# Altium schematic sheet MCU.SchDoc
size A4; SheetNumber: 3; SheetTotal: 4
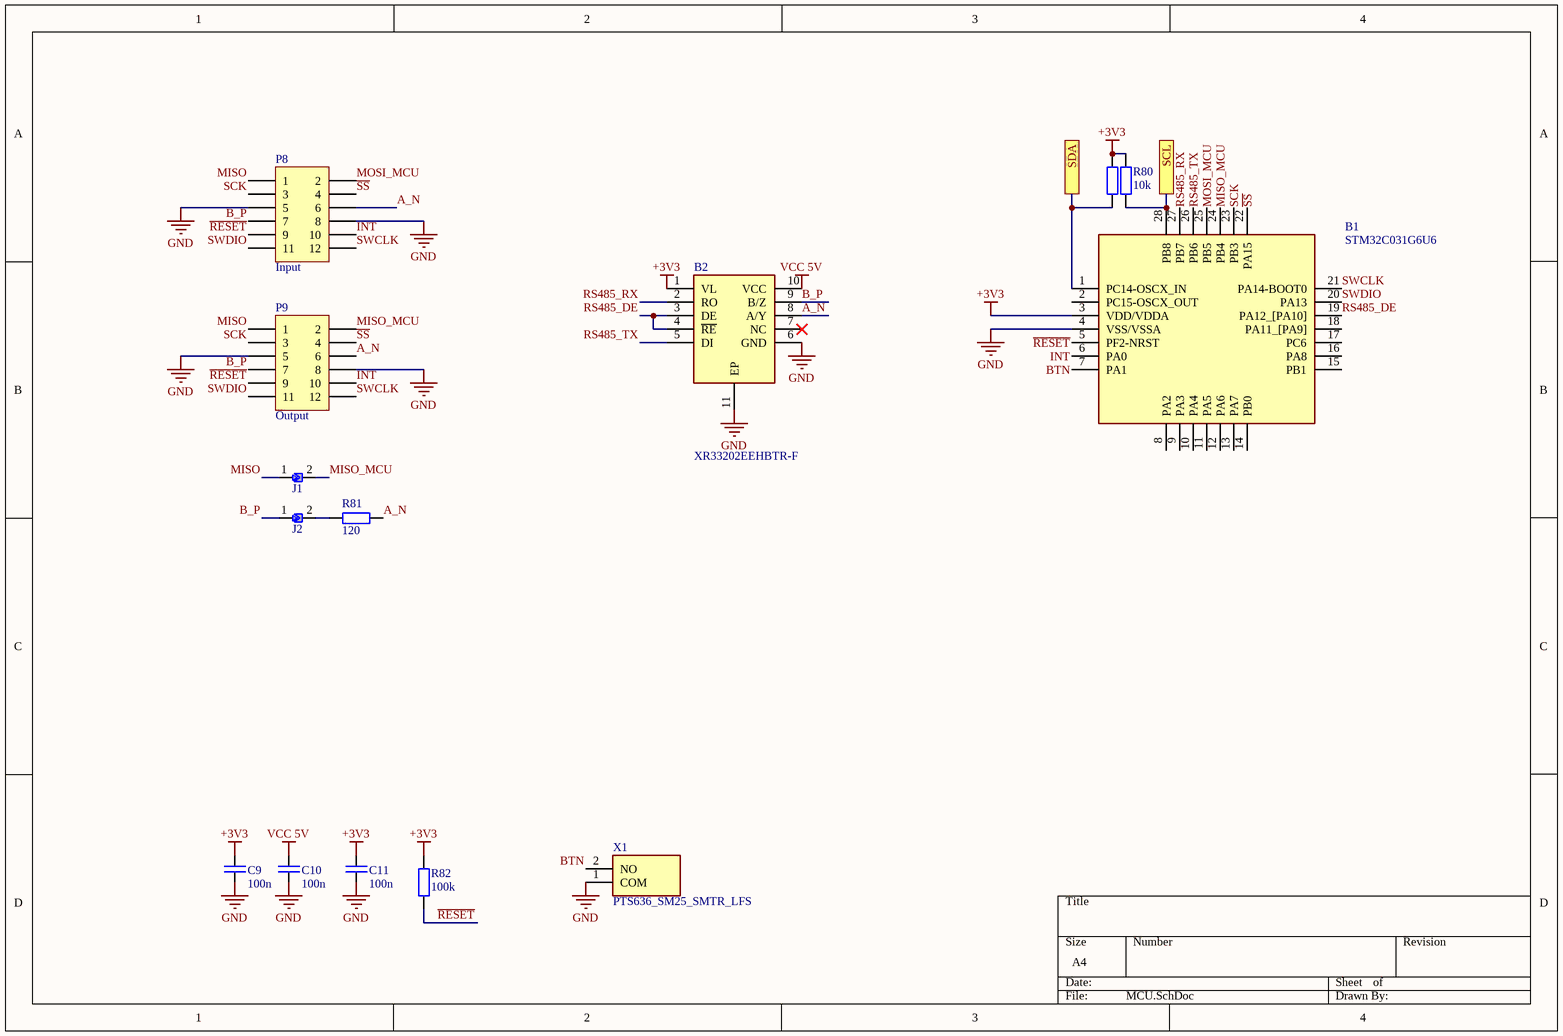
[diagram p0: MCU.SchDoc]

## Parts
B1  STM32C031G6U6  [QFN50P400X400X60-28N-D]
B2  XR33202EEHBTR-F  [SON50P300X300X80-11N-D]
C9  100n  [R1005_0402i_L]
C10  100n  [R1005_0402i_L]
C11  100n  [R1005_0402i_L]
J1  solder_jumper  [solder_jumper_triangle]  (value not drawn)
J2  solder_jumper  [solder_jumper_triangle]  (value not drawn)
P8  Input  [1.27mm SMD conn]
P9  Output  [1.27mm SMD conn]
R79  10k  [R1005_0402i_L]  (value not drawn)
R80  10k  [R1005_0402i_L]
R81  120  [R1005_0402i_L]
R82  100k  [R1005_0402i_L]
X1  PTS636_SM25_SMTR_LFS  [PTS636SM25SMTRLFS]

## Ports
SCL, SDA

## Nets
+3V3: B1.3(VDD/VDDA) B2.1(VL) C9.1 C11.1 R79.1 R80.1 R82.1
GND: B1.4(VSS/VSSA) B2.6(GND) B2.11(EP) C9.2 C10.2 C11.2 P8.5 P8.8 P9.5 P9.8 X1.1(COM)
VCC 5V: B2.10(VCC) C10.1
A_N: B2.8(A/Y) P8.6 P9.6 R81.2
B_P: B2.9(B/Z) J2.1 P8.7 P9.7
BTN: B1.7(PA1) X1.2(NO)
INT: B1.6(PA0) P8.10 P9.10
MISO: J1.1 P8.1 P9.1
MISO_MCU: B1.24(PB4) J1.2 P9.2
MOSI_MCU: B1.25(PB5) P8.2
~{RESET}: B1.5(PF2-NRST) P8.9 P9.9 R82.2
RS485_DE: B1.19(PA12_[PA10]) B2.3(DE) B2.4(~{RE})
RS485_RX: B1.27(PB7) B2.2(RO)
RS485_TX: B1.26(PB6) B2.5(DI)
~{SS}: B1.22(PA15) P8.4 P9.4
SCK: B1.23(PB3) P8.3 P9.3
SCL: B1.28(PB8) R80.2 ; port SCL
SDA: B1.1(PC14-OSCX_IN) R79.2 ; port SDA
SWCLK: B1.21(PA14-BOOT0) P8.12 P9.12
SWDIO: B1.20(PA13) P8.11 P9.11
NetJ2_2: J2.2 R81.1

Not connected (* = marked no-connect by the designer): B1 2(PC15-OSCX_OUT) 8(PA2) 9(PA3) 10(PA4) 11(PA5) 12(PA6) 13(PA7) 14(PB0) 15(PB1) 16(PA8) 17(PC6) 18(PA11_[PA9]); B2 7(NC)*

## Library data of the parts
B1 = STM32C031G6U6: Mainstream Arm Cortex-M0+ MCU with 32 Kbytes of Flash memory, 12 Kbytes RAM, 48 MHz CPU, 2x USART, timers, ADC, comm. I/F, 2-3.6V; Manufacturer_Name: STMicroelectronics; Geometry.Height: 0.6mm; Mouser Part Number: 511-STM32C031G6U6; Mouser Price/Stock: https://www.mouser.co.uk/ProductDetail/STMicroelectronics/STM32C031G6U6?qs=IPgv5n7u5QZqRf3nOTChhw%3D%3D; Manufacturer_Part_Number: STM32C031G6U6; Datasheet Link: https://www.st.com/resource/en/datasheet/stm32c031c4.pdf
B2 = XR33202EEHBTR-F: RS-422/RS-485 Interface IC Wide Supply Trans with I/O Interface; Manufacturer_Name: MaxLinear, Inc.; Geometry.Height: 0.8mm; Mouser Part Number: 701-XR33202EEHBTR-F; Mouser Price/Stock: https://www.mouser.co.uk/ProductDetail/MaxLinear/XR33202EEHBTR-F?qs=GtWAI9k6EVi4nRW8bj1LFw%3D%3D; Manufacturer_Part_Number: XR33202EEHBTR-F; Datasheet Link: https://www.maxlinear.com/ds/xr33202.pdf
C9-C11 = C: Capacitor
P8 P9 = Header 6X2: Header, 6-Pin, Dual row; LatestRevisionDate: 17-Jul-2002; LatestRevisionNote: Re-released for DXP Platform.; Publisher: Altium Limited
R79-R82 = R
X1 = PTS636_SM25_SMTR_LFS: Tactile Switches Tact 50mA 12VDC, 6.0x3.5, 2.5mm H, 180gf, G leads, No ground pin, White Actuator; Manufacturer_Name: C & K COMPONENTS; Manufacturer_Part_Number: PTS636 SM25 SMTR LFS; Geometry.Height: 2.7mm; Mouser Part Number: 611-PTS636SM25SMTRLF; Mouser Price/Stock: https://www.mouser.co.uk/ProductDetail/CK/PTS636-SM25-SMTR-LFS?qs=vLWxofP3U2yIXR4iooxesw%3D%3D; Datasheet Link: https://componentsearchengine.com/Datasheets/1/PTS636 SM25 SMTR LFS.pdf